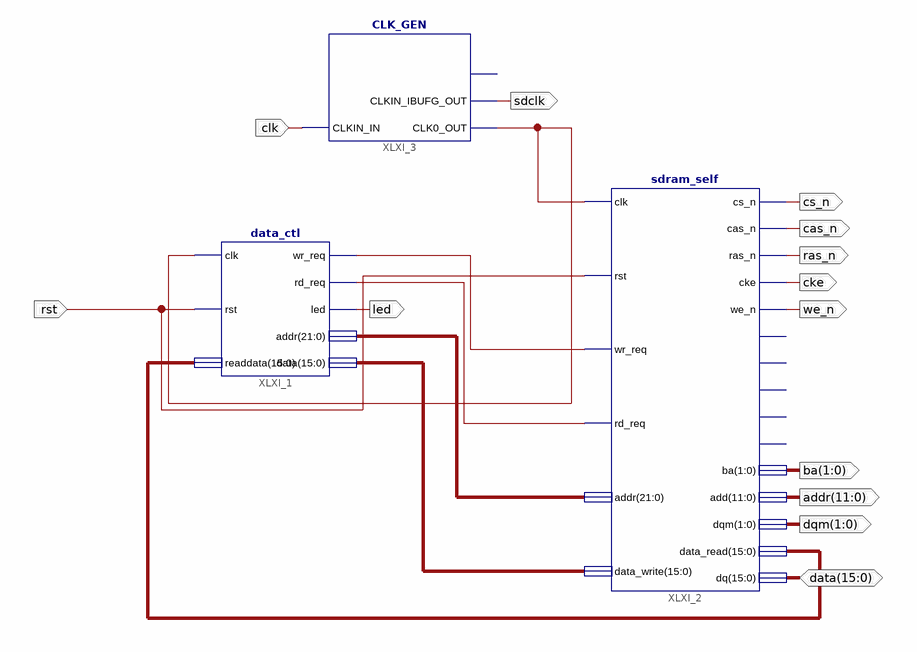
[diagram p0: schematic sheet 1]
// Xilinx ISE schematic top.sch (spartan3e) as structural Verilog: 3 symbols, 13 ports
module top (
  input  clk,
  input  rst,
  inout  [15:0] data,
  output led,
  output cs_n,
  output cas_n,
  output ras_n,
  output cke,
  output we_n,
  output [1:0] ba,
  output [11:0] addr,
  output [1:0] dqm,
  output sdclk
);

  wire XLXN_6, XLXN_7, XLXN_28;
  wire [15:0] XLXN_10, XLXN_11;
  wire [21:0] XLXN_8;

  sdram_self XLXI_2 (
    .clk(XLXN_28), .rst(rst), .wr_req(XLXN_6), .rd_req(XLXN_7), .addr(XLXN_8), .data_write(XLXN_10),
    .cs_n(cs_n), .cas_n(cas_n), .ras_n(ras_n), .cke(cke), .we_n(we_n), .ba(ba), .add(addr), .dqm(dqm),
    .data_read(XLXN_11), .dq(data));  // open: wr_ack, rd_ack, busy, wr_done, rd_done
  CLK_GEN XLXI_3 (.CLKIN_IN(clk), .CLKIN_IBUFG_OUT(sdclk), .CLK0_OUT(XLXN_28));  // open: CLK2X_OUT
  data_ctl XLXI_1 (
    .clk(XLXN_28), .rst(rst), .readdata(XLXN_11), .wr_req(XLXN_6), .rd_req(XLXN_7), .led(led), .addr(XLXN_8),
    .data(XLXN_10));
endmodule
